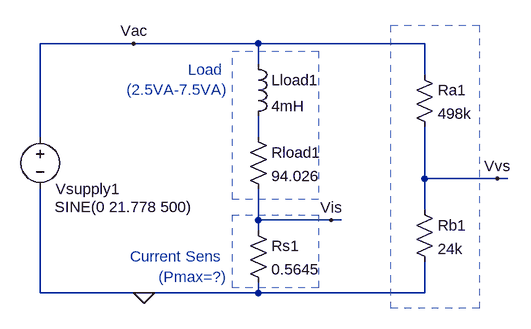
[diagram p0: schematic Sensor_Circtuits.asc]
Sensor_Circtuits.asc, the LTspice schematic file:
Version 4
SHEET 1 880 680
WIRE -48 -128 -192 -128
WIRE 144 -128 -48 -128
WIRE 400 -128 144 -128
WIRE 144 -96 144 -128
WIRE 400 -80 400 -128
WIRE -192 16 -192 -128
WIRE 144 16 144 -16
WIRE 400 80 400 0
WIRE 512 80 400 80
WIRE 528 80 512 80
WIRE 400 128 400 80
WIRE 144 144 144 96
WIRE 256 144 144 144
WIRE 272 144 256 144
WIRE 144 160 144 144
WIRE -192 256 -192 96
WIRE -32 256 -192 256
WIRE 144 256 144 240
WIRE 144 256 -32 256
WIRE 400 256 400 208
WIRE 400 256 144 256
FLAG -32 256 0
FLAG -48 -128 Vac
FLAG 256 144 Vis
FLAG 512 80 Vvs
SYMBOL voltage -192 0 R0
WINDOW 0 24 96 Left 2
WINDOW 3 22 124 Left 2
WINDOW 123 0 0 Left 0
WINDOW 39 0 0 Left 0
SYMATTR InstName Vsupply1
SYMATTR Value SINE(0 21.778 500)
SYMBOL res 128 0 R0
SYMATTR InstName Rload1
SYMATTR Value 94.026
SYMBOL ind 128 -112 R0
SYMATTR InstName Lload1
SYMATTR Value 4mH
SYMBOL res 128 144 R0
SYMATTR InstName Rs1
SYMATTR Value 0.5645
SYMBOL res 384 -96 R0
SYMATTR InstName Ra1
SYMATTR Value 498k
SYMBOL res 384 112 R0
SYMATTR InstName Rb1
SYMATTR Value 24k
TEXT 96 -88 Right 2 ;Load \n(2.5VA-7.5VA)
TEXT 96 200 Right 2 ;Current Sens \n(Pmax=?)
RECTANGLE Normal 348 -156 484 280 2
RECTANGLE Normal 104 -116 236 112 2
RECTANGLE Normal 104 136 236 248 2

The netlist it stands for:
* Sensor_Circtuits.asc
Vsupply1 Vac 0 SINE(0 21.778 500)
Rload1 N001 Vis 94.026
Lload1 Vac N001 4mH
Rs1 Vis 0 0.5645
Ra1 Vac Vvs 498k
Rb1 Vvs 0 24k
* Load
* (2.5VA-7.5VA)
* Current Sens
* (Pmax=?)
.backanno
.end